# EAGLE schematic Amplifier Class AB (EAGLE 7.2.0)
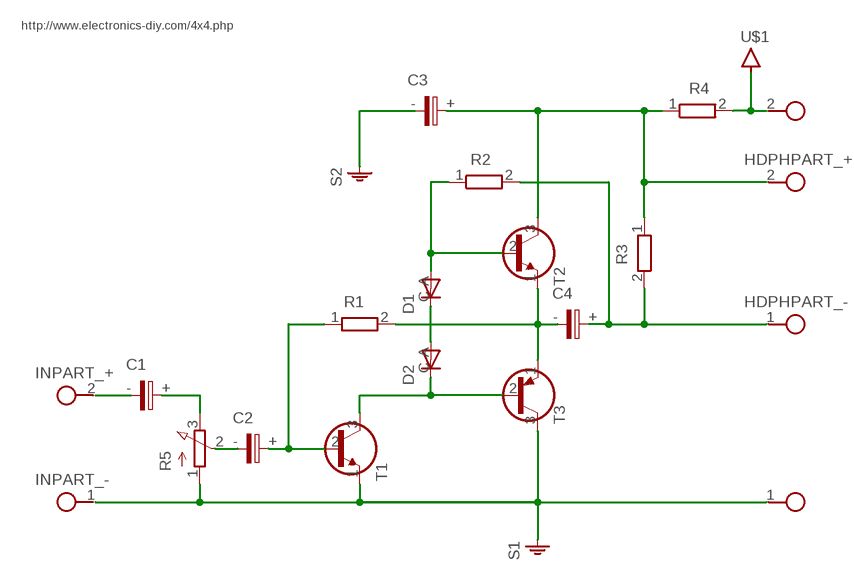
[diagram p0: schematic, sheet 1]

## Parts
BAT  SPAD+-+-_(SPAD+-)  [SPAD+-]
C1  4.7uF  CPOLE2,5-3_(CPOL)  [E2,5-3]
C2  4.7uF  CPOLE2,5-3_(CPOL)  [E2,5-3]
C3  470uF  CPOLE2.5-6_(CPOL)  [E2,5-6]
C4  100uF  CPOLE5-4_(CPOL)  [E5-4]
D1  1N4148  DIODE34-5-V_(DIODE)  [DO34-5-V]
D2  1N4148  DIODE34-5V_(DIODE)  [DO34-5V]
HDPH  SPAD+--+  SPAD+--+_(SPAD+-)_9  [SPAD-+]
IN  SPAD+--+  SPAD+--+_(SPAD+-)  [SPAD-+]
R1  100k  R-H0204/10_(R-H)  [0204/10]
R2  330  R-H0204/10_(R-H)  [0204/10]
R3  100  R0204/10_(R)  [0204/10]
R4  27  R-H0204/10_(R-H)  [0204/10]
R5  100k  POT-3P_(POT)  [CONN-3P]
T1  2N3904  [TO92]
T2  2N3904  [TO92]
T3  2N3906  [TO92]

## Nets
GND: BAT.1 C3.- IN.1 R5.1(A) T1.1(E) T3.3(C)
N$1: D1.A R2.1 T2.2(B)
N$2: D2.C T1.3(C) T3.2(B)
N$3: D1.C D2.A
N$4: C4.- R1.2 T2.1(E) T3.1(E)
N$5: C1.+ R5.3(E)
N$6: C2.- R5.2(S)
N$7: C2.+ R1.1 T1.2(B)
N$8: C3.+ HDPH.2 R3.1 R4.1 T2.3(C)
N$9: C4.+ HDPH.1 R2.2 R3.2
N$10: C1.- IN.2
V+: BAT.2 R4.2

## Notes on the sheet
- http://www.electronics-diy.com/4x4.php

## Library data of the parts
BAT = common:SPAD+-+-_(SPAD+-)
C1 C2 = common:CPOLE2,5-3_(CPOL)
C3 = common:CPOLE2.5-6_(CPOL)
C4 = common:CPOLE5-4_(CPOL)
D1 = common:DIODE34-5-V_(DIODE)
D2 = common:DIODE34-5V_(DIODE)
HDPH = common:SPAD+--+_(SPAD+-)_9
IN = common:SPAD+--+_(SPAD+-)
R1 = common:R-H0204/10_(R-H)
R2 R4 = common:R-H0204/10_(R-H); VALUE: 100k
R3 = common:R0204/10_(R)
R5 = common:POT-3P_(POT)
T1 T2 = common:2N3904
T3 = common:2N3906

## Net classes
0 default: width 0.61 mm